# EAGLE design encoder (EAGLE 7.1.0)
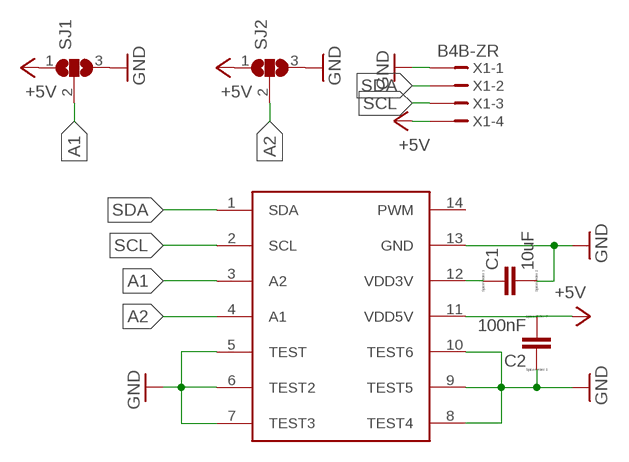
[diagram p0: schematic, sheet 1]

## Parts
C1  10uF  C-EUC0805K  [C0805K]
C2  100nF  C-EUC0805K  [C0805K]
SJ1  SJ2W  [SJ_2]
SJ2  SJ2W  [SJ_2]
U$1  AS5048B  [TSSOP14]
X1  B4B-ZR  [B4B-ZR]

## Nets
+5V: C2.2 SJ1.1 SJ2.1 U$1.11(VDD5V) X1.4
A1: SJ1.2 U$1.3(A2)
A2: SJ2.2 U$1.4(A1)
GND: C1.2 C2.1 SJ1.3 SJ2.3 U$1.5(TEST) U$1.6(TEST2) U$1.7(TEST3) U$1.8(TEST4) U$1.9(TEST5) U$1.10(TEST6) U$1.13(GND) X1.1
N$3: C1.1 U$1.12(VDD3V)
SCL: U$1.2(SCL) X1.3
SDA: U$1.1(SDA) X1.2
Unconnected: U$1.14(PWM)

## Library data of the parts
C1 C2 = resistor:C-EU: CAPACITOR, European symbol; SPICEPREFIX: C
SJ1 SJ2 = jumper:SJ2W: SMD solder JUMPER
U$1 = AMS:AS5048B
X1 = con-jst:?4B-ZR: ZH CONNECTOR 1.5 mm, 4 pin 1 row Source: http://www.jst.com .. eZH.pdf; MF: FARNELL; MPN: B4B-ZR(LF)(SN); OC_FARNELL: 1830916; OC_NEWARK: 37K9960

## Board
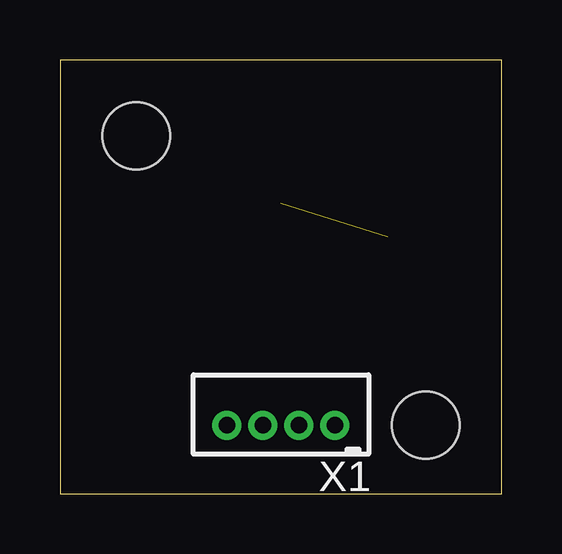
[diagram p1: board, top side]
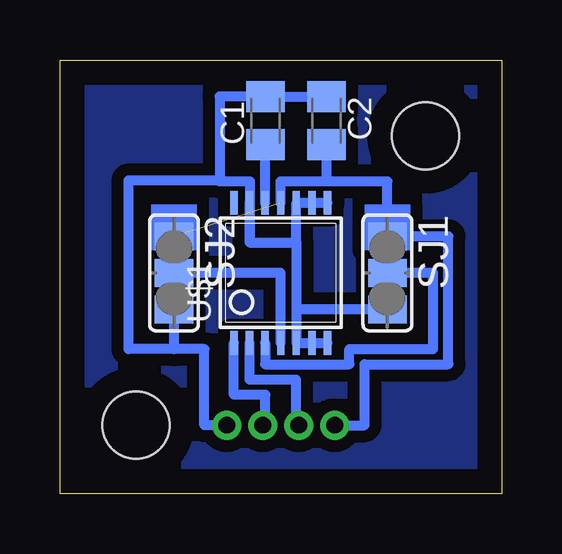
[diagram p2: board, bottom side, seen from below]

Size 18.4 x 18.09 mm. Coordinates in mm from the lower left corner, seen from the top.
Outline: 0,0 18.4,0 18.4,18.09 0,18.09 0,0
Copper layers (1*16): Top 0.035mm / dielectric 1.5mm / Bottom 0.035mm
Design rules "default *": minimum track width 10mil, minimum drill 24mil, track to track 20mil, track to pad 20mil, pad to pad 8mil, via to via 8mil, smd to smd 20mil, copper to edge 40mil, drill to drill 8mil, minimum pad ring 10mil, minimum via ring 8mil, stop-mask expansion 4mil, vias tented up to drill 0mil, thermal gap 10mil
Holes 2.8 mm at 3.17,14.92 15.24,2.86

### Footprints (pad centres in the part's own frame; a part is rotated, then mirrored left to right if it is on the bottom)
C0805K = smd 1.3 x 1.6: 1 -1,0; 2 1,0
SJ_2 = smd 1.168 x 1.6: 1 -1.524,0; 2 0,0; 3 1.524,0
TSSOP14 = smd 0.305 x 0.991: 1 -1.95,-2.918; 2 -1.3,-2.918; 3 -0.65,-2.918; 4 0,-2.918; 5 0.65,-2.918; 6 1.3,-2.918; 7 1.95,-2.918; 8 1.95,2.918; 9 1.3,2.918; 10 0.65,2.918; 11 0,2.918; 12 -0.65,2.918; 13 -1.3,2.918; 14 -1.95,2.918
B4B-ZR = drill 0.7 pad 1.1: 1 -2.25,0; 2 -0.75,0; 3 0.75,0; 4 2.25,0

### Placement (x,y rotation side)
C1  9.84,15.56 90 bottom
C2  7.3,15.56 270 bottom
SJ1  4.76,9.21 270 bottom
SJ2  13.65,9.21 270 bottom
U$1  9.21,9.21 0 bottom
X1  9.21,2.86 180 top

### Tracks (layer width: path | path; a pad name or v marks a point on that pad's centre or on a via)
+5V  (1 unrouted)
  Bottom 0.406: U$1.11 9.21,13.02 7.3,13.02 | 7.3,13.02 4.76,13.02 SJ1.1 2.22,10.73 2.22,5.4 5.71,5.4 5.71,2.86 X1.4 | C2.2 7.3,13.02
A1
  Bottom 0.406: U$1.3 9.86,5.4 6.35,5.4 6.35,6.03 2.86,6.03 2.86,9.21 SJ1.2
A2
  Bottom 0.406: U$1.4 9.21,9.21 SJ2.2
GND
  Bottom 0.406: U$1.7 U$1.6 U$1.5 8.56,7.68 | U$1.8 U$1.9 U$1.10 8.56,10.48 | 13.65,6.03 SJ2.3 | U$1.13 10.51,10.48 10.48,10.48 | 10.48,10.48 8.56,10.48 | X1.1 12.38,2.86 12.38,6.03 13.65,6.03 | 13.65,6.03 15.56,6.03 15.56,13.06 11.75,13.06 | 8.56,10.48 8.56,7.68 | C2.1 C1.2 11.75,16.56 11.75,13.06 | 11.75,13.06 11.75,13.02 10.48,13.02 10.48,10.48 | SJ1.3 8.56,7.68
N$1
  pour Bottom: 0,18.1 18.41,18.1 18.41,0 0,0
N$3
  Bottom 0.406: U$1.12 9.86,14.56 C1.1
SCL
  Bottom 0.406: U$1.2 10.51,4.76 8.57,4.76 8.57,2.86 X1.3
SDA
  Bottom 0.406: X1.2 9.84,2.86 9.84,4.13 11.16,4.13 U$1.1
(copper drawn outside any net)
  shapes: Bottom area x2